# Altium schematic sheet Power.SchDoc
size C; DocumentNumber: 3; SheetNumber: 3; SheetTotal: 8
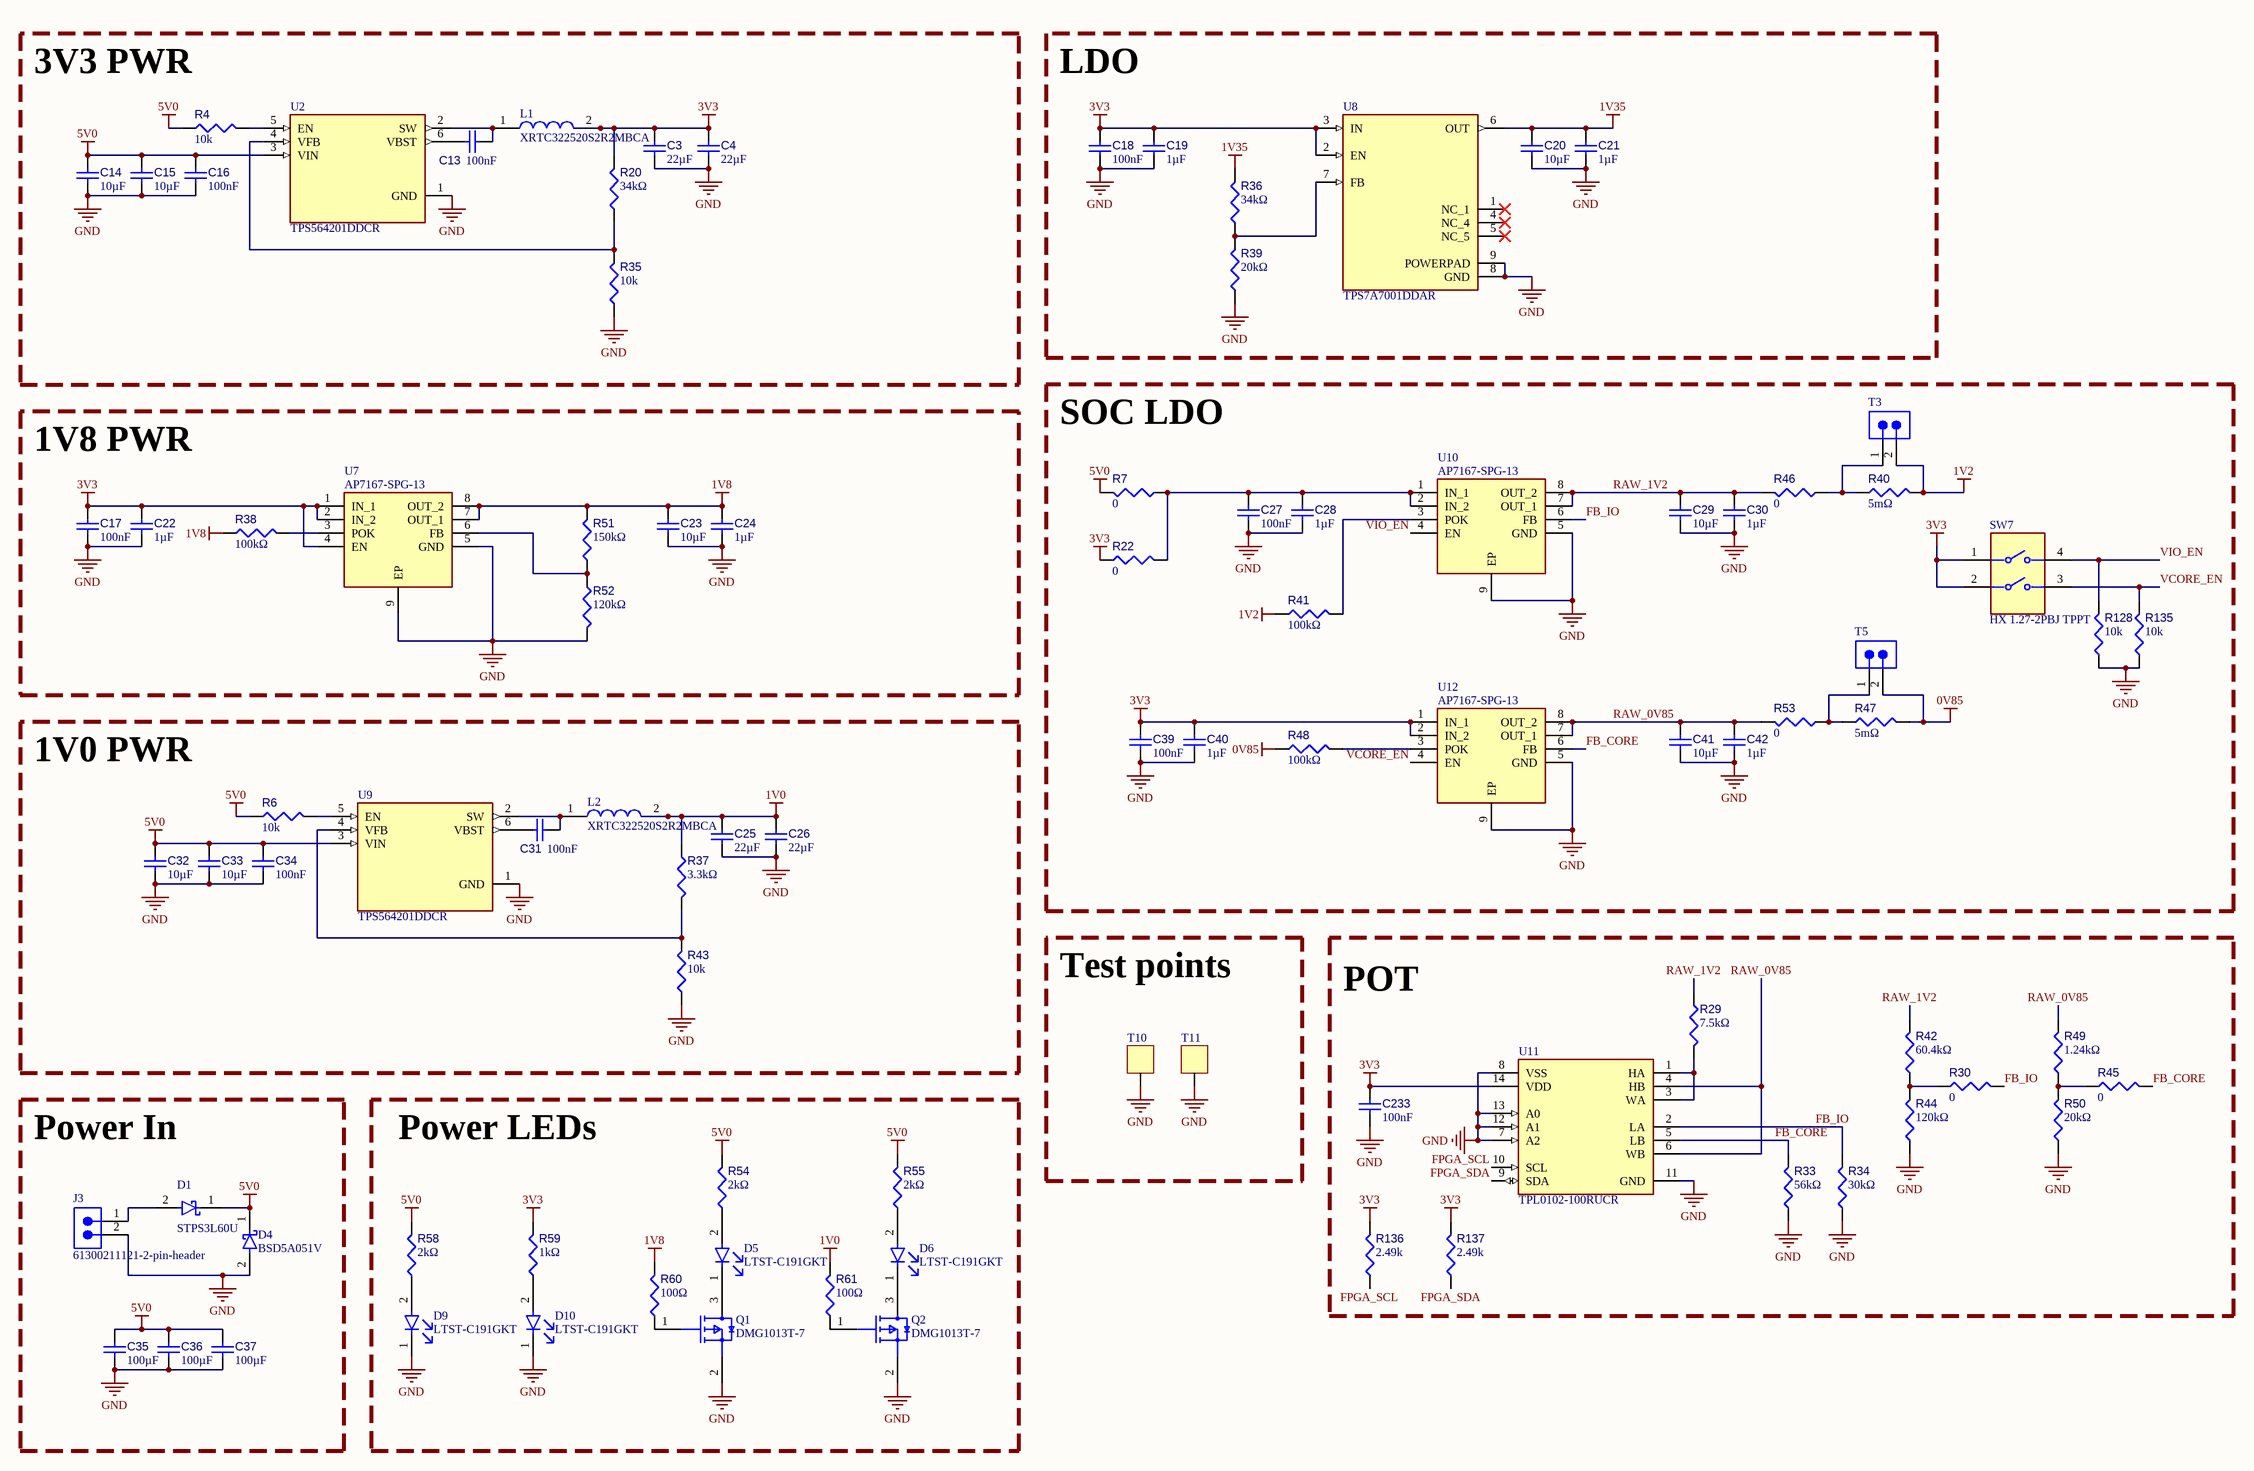
[diagram p0: Power.SchDoc]

## Parts
C3  value 22µF  [CAP-0603-MFG]  (hidden comment: CL10A226MO7JZNC)
C4  value 22µF  [CAP-0603-MFG]  (hidden comment: CL10A226MO7JZNC)
C13  value 100nF  [CAP-0402-MFG]  (hidden comment: CL05B104KA54PNC)
C14  value 10µF  [CAP-0402-MFG]  (hidden comment: CL05A106MP5NUNC)
C15  value 10µF  [CAP-0402-MFG]  (hidden comment: CL05A106MP5NUNC)
C16  value 100nF  [CAP-0402-MFG]  (hidden comment: CL05B104KA54PNC)
C17  value 100nF  [CAP-0402-MFG]  (hidden comment: CL05B104KA54PNC)
C18  value 100nF  [CAP-0402-MFG]  (hidden comment: CL05B104KA54PNC)
C19  value 1µF  [CAP-0402-MFG]  (hidden comment: GRT155C81C105KE13J)
C20  value 10µF  [CAP-0402-MFG]  (hidden comment: CL05A106MP5NUNC)
C21  value 1µF  [CAP-0402-MFG]  (hidden comment: GRT155C81C105KE13J)
C22  value 1µF  [CAP-0402-MFG]  (hidden comment: GRT155C81C105KE13J)
C23  value 10µF  [CAP-0402-MFG]  (hidden comment: CL05A106MP5NUNC)
C24  value 1µF  [CAP-0402-MFG]  (hidden comment: GRT155C81C105KE13J)
C25  value 22µF  [CAP-0603-MFG]  (hidden comment: CL10A226MO7JZNC)
C26  value 22µF  [CAP-0603-MFG]  (hidden comment: CL10A226MO7JZNC)
C27  value 100nF  [CAP-0402-MFG]  (hidden comment: CL05B104KA54PNC)
C28  value 1µF  [CAP-0402-MFG]  (hidden comment: GRT155C81C105KE13J)
C29  value 10µF  [CAP-0402-MFG]  (hidden comment: CL05A106MP5NUNC)
C30  value 1µF  [CAP-0402-MFG]  (hidden comment: GRT155C81C105KE13J)
C31  value 100nF  [CAP-0402-MFG]  (hidden comment: CL05B104KA54PNC)
C32  value 10µF  [CAP-0402-MFG]  (hidden comment: CL05A106MP5NUNC)
C33  value 10µF  [CAP-0402-MFG]  (hidden comment: CL05A106MP5NUNC)
C34  value 100nF  [CAP-0402-MFG]  (hidden comment: CL05B104KA54PNC)
C35  value 100µF  [CAP-0805-MFG]  (hidden comment: GRM21BR60J107ME15L)
C36  value 100µF  [CAP-0805-MFG]  (hidden comment: GRM21BR60J107ME15L)
C37  value 100µF  [CAP-0805-MFG]  (hidden comment: GRM21BR60J107ME15L)
C39  value 100nF  [CAP-0402-MFG]  (hidden comment: CL05B104KA54PNC)
C40  value 1µF  [CAP-0402-MFG]  (hidden comment: GRT155C81C105KE13J)
C41  value 10µF  [CAP-0402-MFG]  (hidden comment: CL05A106MP5NUNC)
C42  value 1µF  [CAP-0402-MFG]  (hidden comment: GRT155C81C105KE13J)
C233  value 100nF  [CAP-0402-MFG]  (hidden comment: CL05B104KA54PNC)
D1  STPS3L60U  [FP-DO214AA-MFG]
D4  BSD5A051V  [SOD-523]
D5  LTST-C191GKT  [LED-0603-MFG]
D6  LTST-C191GKT  [LED-0603-MFG]
D9  LTST-C191GKT  [LED-0603-MFG]
D10  LTST-C191GKT  [LED-0603-MFG]
J3  61300211121-2-pin-header  [61300211121]
L1  XRTC322520S2R2MBCA  [INDC2520X100N]
L2  XRTC322520S2R2MBCA  [INDC2520X100N]
Q1  DMG1013T-7  [FP-SOT523-MFG]
Q2  DMG1013T-7  [FP-SOT523-MFG]
R4  value 10k  [RES-0402]  (hidden comment: AC0402FR-0710KL)
R6  value 10k  [RES-0402]  (hidden comment: AC0402FR-0710KL)
R7  value 0  [RES-0402]  (hidden comment: AC0402JR-130RL)
R20  value 34kΩ  [RES-0402]  (hidden comment: AC0402FR-0734KL)
R22  value 0  [RES-0402]  (hidden comment: AC0402JR-130RL)
R29  value 7.5kΩ  [RES-0402]  (hidden comment: AC0402FR-077K5L)
R30  value 0  [RES-0402]  (hidden comment: AC0402JR-130RL)
R33  value 56kΩ  [RES-0402]  (hidden comment: AF0402FR-0756KL)
R34  value 30kΩ  [RES-0402]  (hidden comment: AC0402FR-0730KL)
R35  value 10k  [RES-0402]  (hidden comment: AC0402FR-0710KL)
R36  value 34kΩ  [RES-0402]  (hidden comment: AC0402FR-0734KL)
R37  value 3.3kΩ  [RES-0402]  (hidden comment: CRCW04023K30FKED)
R38  value 100kΩ  [RES-0402]  (hidden comment: AC0402FR-07100KL)
R39  value 20kΩ  [RES-0402]  (hidden comment: AC0402FR-0720KL)
R40  value 5mΩ  [RES-0603-MFG]  (hidden comment: PA0603FRE570R005L)
R41  value 100kΩ  [RES-0402]  (hidden comment: AC0402FR-07100KL)
R42  value 60.4kΩ  [RES-0402]  (hidden comment: AC0402FR-0760K4L)
R43  value 10k  [RES-0402]  (hidden comment: AC0402FR-0710KL)
R44  value 120kΩ  [RES-0402]  (hidden comment: AC0402FR-07120KL)
R45  value 0  [RES-0402]  (hidden comment: AC0402JR-130RL)
R46  value 0  [RES-0603-MFG]  (hidden comment: AC0603FR-070RL)
R47  value 5mΩ  [RES-0603-MFG]  (hidden comment: PA0603FRE570R005L)
R48  value 100kΩ  [RES-0402]  (hidden comment: AC0402FR-07100KL)
R49  value 1.24kΩ  [RES-0402]  (hidden comment: AC0402FR-071K24L)
R50  value 20kΩ  [RES-0402]  (hidden comment: AC0402FR-0720KL)
R51  value 150kΩ  [RES-0402]  (hidden comment: AF0402FR-07150KL)
R52  value 120kΩ  [RES-0402]  (hidden comment: AC0402FR-07120KL)
R53  value 0  [RES-0603-MFG]  (hidden comment: AC0603FR-070RL)
R54  value 2kΩ  [RES-0402]  (hidden comment: AC0402FR-072KL)
R55  value 2kΩ  [RES-0402]  (hidden comment: AC0402FR-072KL)
R58  value 2kΩ  [RES-0402]  (hidden comment: AC0402FR-072KL)
R59  value 1kΩ  [RES-0402]  (hidden comment: AC0402FR-071KL)
R60  value 100Ω  [RES-0402]  (hidden comment: AC0402FR-07100RL)
R61  value 100Ω  [RES-0402]  (hidden comment: AC0402FR-07100RL)
R128  value 10k  [RES-0402]  (hidden comment: AC0402FR-0710KL)
R135  value 10k  [RES-0402]  (hidden comment: AC0402FR-0710KL)
R136  value 2.49k  [RES-0402]  (hidden comment: AC0402FR-072K49L)
R137  value 2.49k  [RES-0402]  (hidden comment: AC0402FR-072K49L)
SW7  HX 1.27-2PBJ TPPT  [HX 1.27-2PBJ TPPT-Footprint-1]
T3  61300211121-2-pin-header  [61300211121]  (value not drawn)
T5  61300211121-2-pin-header  [61300211121]  (value not drawn)
T10  TEST_PT  [TP-100X100/ROUND-THT]  (value not drawn)
T11  TEST_PT  [TP-100X100/ROUND-THT]  (value not drawn)
U2  TPS564201DDCR  [SOT95P280X110-6N]
U7  AP7167-SPG-13  [SOIC127P600X175-9N]
U8  TPS7A7001DDAR  [VREG_TPS7A7001DDAR]
U9  TPS564201DDCR  [SOT95P280X110-6N]
U10  AP7167-SPG-13  [SOIC127P600X175-9N]
U11  TPL0102-100RUCR  [FP-RUC0014A-IPC_B]
U12  AP7167-SPG-13  [SOIC127P600X175-9N]

## Blocks framed on the sheet
3V3 PWR: C3 C4 C13-C16 L1 R4 R20 R35 U2
LDO: C18-C21 R36 R39 U8
SOC LDO: C27-C30 C39-C42 R7 R22 R40 R41 R46-R48 R53 R128 R135 SW7 T3 T5 U10 U12
1V8 PWR: C17 C22-C24 R38 R51 R52 U7
1V0 PWR: C25 C26 C31-C34 L2 R6 R37 R43 U9
Test points: T10 T11
POT: C233 R29 R30 R33 R34 R42 R44 R45 R49 R50 R136 R137 U11
Power In: C35-C37 D1 D4 J3
Power LEDs: D5 D6 D9 D10 Q1 Q2 R54 R55 R58-R61

## Nets
0V85: R47.2 R48.1 T5.2
1V0: C25.1 C26.1 L2.2 R37.1 R61.2
1V2: R40.2 R41.1 T3.2
1V8: C23.1 C24.1 R38.1 R51.2 R60.2 U7.7(OUT_1) U7.8(OUT_2)
1V35: C20.2 C21.1 R36.2 U8.6(OUT)
3V3: C3.1 C4.1 C17.1 C18.1 C19.1 C22.1 C39.1 C40.1 C233.1 L1.2 R20.2 R22.1 R59.2 R136.2 R137.2 SW7.1 SW7.2 U7.1(IN_1) U7.2(IN_2) U7.4(EN) U8.2(EN) U8.3(IN) U11.14(VDD) U12.1(IN_1) U12.2(IN_2)
5V0: C14.1 C15.1 C16.1 C32.1 C33.2 C34.2 C35.1 C36.1 C37.1 D1.1(K) D4.1(K) R4.1 R6.1 R7.2 R54.2 R55.2 R58.2 U2.3(VIN) U9.3(VIN)
GND: C3.2 C4.2 C14.2 C15.2 C16.2 C17.2 C18.2 C19.2 C20.1 C21.2 C22.2 C23.2 C24.2 C25.2 C26.2 C27.2 C28.2 C29.2 C30.2 C32.2 C33.1 C34.1 C35.2 C36.2 C37.2 C39.2 C40.2 C41.2 C42.2 C233.2 D4.2(A) D9.1(C) D10.1(C) J3.2 Q1.2(S) Q2.2(S) R33.1 R34.1 R35.1 R39.1 R43.1 R44.1 R50.1 R52.2 R128.1 R135.1 T10.1 T11.1 U2.1(GND) U7.5(GND) U7.9(EP) U8.8(GND) U8.9(POWERPAD) U9.1(GND) U10.5(GND) U10.9(EP) U11.7(A2) U11.8(VSS) U11.11(GND) U11.12(A1) U11.13(A0) U12.5(GND) U12.9(EP)
FB_CORE: R33.2 R45.2 U11.5(LB) U12.6(FB)
FB_IO: R30.2 R34.2 U10.6(FB) U11.2(LA)
FPGA_SCL: R136.1 U11.10(SCL)
FPGA_SDA: R137.1 U11.9(SDA)
RAW_0V85: C41.1 C42.1 R49.2 R53.2 U11.4(HB) U11.6(WB) U12.7(OUT_1) U12.8(OUT_2)
RAW_1V2: C29.1 C30.1 R29.1 R42.2 R46.2 U10.7(OUT_1) U10.8(OUT_2)
VCORE_EN: R135.2 SW7.3 U12.4(EN)
VIO_EN: R128.2 SW7.4 U10.4(EN)
NetC13_1: C13.1 L1.1 U2.2(SW)
NetC13_2: C13.2 U2.6(VBST)
NetC27_1: C27.1 C28.1 R7.1 R22.2 U10.1(IN_1) U10.2(IN_2)
NetC31_1: C31.1 U9.6(VBST)
NetC31_2: C31.2 L2.1 U9.2(SW)
NetD1_2: D1.2(A) J3.1
NetD5_1: D5.1(C) Q1.3(D)
NetD5_2: D5.2(A) R54.1
NetD6_1: D6.1(C) Q2.3(D)
NetD6_2: D6.2(A) R55.1
NetD9_2: D9.2(A) R58.1
NetD10_2: D10.2(A) R59.1
NetQ1_1: Q1.1(G) R60.1
NetQ2_1: Q2.1(G) R61.1
NetR4_2: R4.2 U2.5(EN)
NetR6_2: R6.2 U9.5(EN)
NetR20_1: R20.1 R35.2 U2.4(VFB)
NetR29_2: R29.2 U11.1(HA) U11.3(WA)
NetR30_1: R30.1 R42.1 R44.2
NetR36_1: R36.1 R39.2 U8.7(FB)
NetR37_2: R37.2 R43.2 U9.4(VFB)
NetR38_2: R38.2 U7.3(POK)
NetR40_1: R40.1 R46.1 T3.1
NetR41_2: R41.2 U10.3(POK)
NetR45_1: R45.1 R49.1 R50.2
NetR47_1: R47.1 R53.1 T5.1
NetR48_2: R48.2 U12.3(POK)
NetR51_1: R51.1 R52.1 U7.6(FB)

Not connected (* = marked no-connect by the designer): U8 1(NC_1)* 4(NC_4)* 5(NC_5)*

## Library data of the parts
C3 C4 C25 C26 = CMP-104-000117-3: 0603-22u-20%-16V-X5R; Manufacturer Name: Samsung Electro-Mechanics; Tolerance: 20%; Voltage Rating: 16V; Capacitor Type: Ceramic; JLC PN: C2762594; Manufacturer Part Number: CL10A226MO7JZNC; Component Type: Standard; Mounting Technology: Surface Mount; Pins: 2; Pin Count: 2; Design Item ID: CMP-001-00130-1; Info: 0603-22u-20%-16V-X5R; Source: Components - 11.02.26 - 17.26.SchLib; Min Operating Temperature: -55°C; Max Operating Temperature: 85°C; Case/Package: 0603
C13 C16 C31 C34 = CMP-104-000104-6: 0402-100n-10%-25V-X7R-AECQ200; Manufacturer Name: Samsung; Tolerance: 10%; Voltage Rating: 25V; Capacitor Type: Ceramic; Temp Code: X7R; Min Operating Temperature: -55°C; Mounting Technology: Surface Mount; Case/Package: 0402; Max Operating Temperature: 125°C; Pins: 2; Manufacturer Part Number: CL05B104KA54PNC; Design Item ID: CMP-001-00131-1; Source: Components - 11.02.26 - 17.26.SchLib; Info: 0402-100n-10%-25V-X7R-AECQ200; Pin Count: 2; Component Type: Standard; JLC PN: C346180
C14 C15 C20 C23 C29 C32 C33 C41 = CMP-104-000115-6: 0402-10u-20%-10V-X5R; Manufacturer Name: Samsung Electro-Mechanics; Temp Code: X5R; Voltage Rating: 10V; Tolerance: 20%; Capacitor Type: Ceramic; Info: 0402-10u-20%-10V-X5R; Case/Package: 0402; Pins: 2; Max Operating Temperature: 85°C; Mounting Technology: Surface Mount; JLC PN: C315248; Min Operating Temperature: -55°C; Design Item ID: CMP-001-00111-7; Pin Count: 2; Component Type: Standard; Source: Components - 11.02.26 - 17.26.SchLib; Manufacturer Part Number: CL05A106MP5NUNC
C17 C18 C27 C39 C233 = CMP-104-000104-6: 0402-100n-10%-25V-X7R-AECQ200; Manufacturer Name: Samsung; Capacitor Type: Ceramic; Voltage Rating: 25V; Tolerance: 10%; Temp Code: X7R; Min Operating Temperature: -55°C; Component Type: Standard; Max Operating Temperature: 125°C; Case/Package: 0402; Info: 0402-100n-10%-25V-X7R-AECQ200; Pins: 2; Pin Count: 2; Mounting Technology: Surface Mount; Manufacturer Part Number: CL05B104KA54PNC; Design Item ID: CMP-001-00131-1; Source: Components - 11.02.26 - 17.26.SchLib; JLC PN: C346180
C19 C21 C22 C24 C28 C30 C40 C42 = CMP-104-000087-6: 0402-1u-10%-16V-X6S-AECQ200; Manufacturer Name: Murata; Temp Code: X6S; Voltage Rating: 16V; Capacitor Type: Ceramic; Tolerance: 10%; Min Operating Temperature: -55°C; Pin Count: 2; Design Item ID: CMP-001-00112-5; Manufacturer Part Number: GRT155C81C105KE13J; Info: 0402-1u-10%-16V-X6S-AECQ200; Mounting Technology: Surface Mount; Component Type: Standard; Case/Package: 0402; Source: Components - 11.02.26 - 17.26.SchLib; Max Operating Temperature: 105°C; Pins: 2; JLC PN: C908010
C35-C37 = CMP-104-000118-4: 0805-100u-20%-6.3V-X5R; Manufacturer Name: Murata; Voltage Rating: 6.3V; Temp Code: X5R; Capacitor Type: Ceramic; Tolerance: 20%; Design Item ID: CMP-001-00132-1; Source: Components - 11.02.26 - 17.26.SchLib; Min Operating Temperature: -55°C; Info: 0805-100u-20%-6.3V-X5R; Mounting Technology: Surface Mount; JLC PN: C141660; Case/Package: 0805; Component Type: Standard; Pin Count: 2; Max Operating Temperature: 85°C; Manufacturer Part Number: GRM21BR60J107ME15L; Pins: 2
D1 = CMP-090-000051-3: DO214AA-UNI-SCHOTTKY-60V-3A-590mV; Manufacturer Name: STMicroelectronics; Forward Current: 3A; Reverse Standoff Voltage: 60V; Max Reverse Leakage Current: 150µA; Forward Voltage: 590mV; Max Operating Temperature: 150°C; Min Operating Temperature: -65°C; Mounting Technology: Surface Mount; Case/Package: DO-214AA, SMB; Info: DO214AA-UNI-SCHOTTKY-60V-3A-590mV; JLC PN: C132769; Manufacturer Part Number: STPS3L60U
D4 = CMP-090-000052-2: TVS ESD protection clamp generic; Manufacturer Name: BORN; Source: BWRC.SchLib; Package: SOD-523; Design Item ID: DISCRETE_TVS; JLC PN: C151987; Manufacturer Part Number: BSD5A051V
D5 D6 D9 D10 = CMP-132-000002-2: LED yellow green 0603 wavelength 569nm light intensity 12mcd Front Mounting; Manufacturer Name: Lite-On; Forward Current: 30mA; Viewing Angle: 130°; Power Rating: 100mW; Forward Voltage: 2.6V; Pins: 2; JLC PN: C99289; Color: Green; Max Operating Temperature: 85°C; Wavelength: 569nm; Manufacturer Part Number: LTST-C191GKT; Case/Package: 0603; Min Operating Temperature: -55°C; Mounting Technology: Surface Mount
J3 = CMP-00023-3: Board Connector, 2 Contact(s), 1 Row(s), Male, Straight, 0.1 inch Pitch, Solder Terminal, Locking, Black Insulator, Plug; Manufacturer Name: Wurth Electronik; Number Of Connectors: 1; Rated Current (Signal): 3A; Reference Standard: UL; PCB Contact Pattern: RECTANGULAR; Body Length: 0.2inch; DIN Conformance: No; Option: General Purpose; Number of Contacts: 2; Contact Style: SQ PIN-SKT; Dielectric Withstanding Voltage (AC): 500V; Contact Resistance: 20mR; Reliability: COMMERCIAL; Insulation Resistance: 1GR; Mounting Technology: Board; Mating Contact Pitch: 0.1inch; Insulation Material: Polybutylene; Terminal Length: 0.118inch; RoHS Compliant: Yes; Body/Shell Style: PLUG; Flammability Rating: UL94 V-0; Body Breadth: 0.1inch; Termination: Solder; Manufacturer Part Number: 61300211121; Max Operating Temperature: 125°C; Mounting Style: STRAIGHT; IEC Conformance: No; JLC PN: C2915055; Number of Rows Loaded: 1; Contact Material: Copper Alloy; Min Operating Temperature: -40°C; Contact Pattern: RECTANGULAR; MIL Conformance: No; Contact Finish - Mating: GOLD; Body Depth: 0.1inch; Connector Type: BOARD CONNECTOR; Mixed Contacts: No; Terminal Pitch: 2.54mm; Insulation Color: Black; Contact Finish - Termination: Gold (Au) - with Nickel (Ni) barrier; Reach SVHC Compliant: Yes; JESD-609 Code: e4; Contact Gender: Male; Filter Feature: No; Mounting Option 1: LOCKING
L1 L2 = CMP-009-000011-4: Ind,3.2x2.5x1mm,2.2uH?20%,4A,shd; Manufacturer Name: XR; Design Item ID: XRTC322520S2R2MBCA; Source: SamacSys.SchLib; Height: 1mm; JLC PN: C48391578; Manufacturer Part Number: XRTC322520S2R2MBCA
Q1 Q2 = CMP-00055-3: P-Channel 20 V 0.7 Ohm 0.27 W Enhancement Mode Mosfet - SOT-523; Manufacturer Name: Diodes Inc; Power Dissipation: 270mW; Rds On Max: 700mΩ; Drain to Source Voltage (Vdss): -20V; Gate to Source Voltage (Vgs): 6V; Max Operating Temperature: 150°C; Min Operating Temperature: -55°C; Mounting Technology: Surface Mount; Max Power Dissipation: 270mW; Case/Package: SOT-523; Pins: 3; JLC PN: C96676; Manufacturer Part Number: DMG1013T-7
R4 R6 R35 R43 = CMP-014-000077-5: 0402-10k-1%-1/16W-AEC-Q200; Manufacturer Name: YAGEO; Voltage Rating: 50V; Power: 63mW; Tolerance: 1%; Max Operating Temperature: 155°C; Case/Package: 0402; Mounting Technology: Surface Mount; Pins: 2; Min Operating Temperature: -55°C; Source: Components - 11.02.26 - 17.27.SchLib; Design Item ID: CMP-009-00191-3; Info: 0402-10k-1%-1/16W-AEC-Q200; Pin Count: 2; Component Type: Standard; Manufacturer Part Number: AC0402FR-0710KL; JLC PN: C144807
R7 R22 R30 R45 = CMP-014-000080-5: 0402-0-1A-AEC-Q200; Manufacturer Name: YAGEO; Current Rating: 1A; Voltage Rating: 50V; Manufacturer Part Number: AC0402JR-130RL; Pin Count: 2; Source: Components - 11.02.26 - 17.27.SchLib; Min Operating Temperature: -55°C; Component Type: Standard; Max Operating Temperature: 155°C; Design Item ID: CMP-009-00194-1; Mounting Technology: Surface Mount; Info: 0402-0-1A-AEC-Q200; Pins: 2; Case/Package: 0402; JLC PN: C4288031
R20 R36 = CMP-014-000101-4: 0402-34k-1%-1/16W-AEC-Q200; Manufacturer Name: YAGEO; Tolerance: 1%; Power: 63mW; Voltage Rating: 50V; Pins: 2; Pin Count: 2; Max Operating Temperature: 155°C; Case/Package: 0402; Info: 0402-34k-1%-1/16W-AEC-Q200; Component Type: Standard; Design Item ID: CMP-009-00208-2; Min Operating Temperature: -55°C; Source: Components - 11.02.26 - 17.27.SchLib; Manufacturer Part Number: AC0402FR-0734KL; Mounting Technology: Surface Mount; JLC PN: C227006
R29 = CMP-014-000115-4: 0402-7.5k-1%-1/16W-AEC-Q200; Manufacturer Name: Vishay; Manufacturer Part Number: CRCW04027K50FKED; Voltage Rating: 50V; Tolerance: 1%; Power: 63mW; Component Type: Standard; Pins: 2; Case/Package: 0402; Pin Count: 2; Info: 0402-7.5k-1%-1/16W-AEC-Q200; Max Operating Temperature: 155°C; Mounting Technology: Surface Mount; Design Item ID: CMP-009-00197-1; Min Operating Temperature: -55°C; Source: Components - 11.02.26 - 17.27.SchLib; JLC PN: C482236
R33 = CMP-014-000113-4: 0402-56k-1%-1/16W-AEC-Q200; Manufacturer Name: YAGEO; Tolerance: 1%; Voltage Rating: 50V; Power: 63mW; Min Operating Temperature: -55°C; Design Item ID: CMP-009-00210-1; Source: Components - 11.02.26 - 17.27.SchLib; Mounting Technology: Surface Mount; Manufacturer Part Number: AF0402FR-0756KL; Pins: 2; Max Operating Temperature: 155°C; Info: 0402-56k-1%-1/16W-AEC-Q200; Case/Package: 0402; JLC PN: C4288121
R34 = CMP-014-000114-4: 0402-30k-1%-1/16W-AEC-Q200; Manufacturer Name: YAGEO; Tolerance: 1%; Power: 63mW; Voltage Rating: 50V; Info: 0402-30k-1%-1/16W-AEC-Q200; Mounting Technology: Surface Mount; Source: Components - 11.02.26 - 17.27.SchLib; Max Operating Temperature: 155°C; Design Item ID: CMP-009-00210-1; Case/Package: 0402; Min Operating Temperature: -55°C; Pins: 2; Manufacturer Part Number: AC0402FR-0730KL; JLC PN: C412503
R37 = CMP-014-000106-4: 0402-3.3k-1%-1/16W-AEC-Q200; Manufacturer Name: Vishay; Power: 63mW; Tolerance: 1%; Voltage Rating: 50V; Mounting Technology: Surface Mount; Case/Package: 0402; Design Item ID: CMP-009-00197-1; Component Type: Standard; Info: 0402-3.3k-1%-1/16W-AEC-Q200; Min Operating Temperature: -55°C; Pin Count: 2; Source: Components - 11.02.26 - 17.27.SchLib; Pins: 2; Max Operating Temperature: 155°C; Manufacturer Part Number: CRCW04023K30FKED; JLC PN: C482167
R38 R41 R48 = CMP-014-000103-4: 0402-100k-1%-1/16W-AEC-Q200; Manufacturer Name: YAGEO; Tolerance: 1%; Voltage Rating: 50V; Power: 63mW; Min Operating Temperature: -55°C; Pin Count: 2; Component Type: Standard; Manufacturer Part Number: AC0402FR-07100KL; Design Item ID: CMP-009-00205-1; Source: Components - 11.02.26 - 17.27.SchLib; Mounting Technology: Surface Mount; Case/Package: 0402; Pins: 2; Info: 0402-100k-1%-1/16W-AEC-Q200; Max Operating Temperature: 155°C; JLC PN: C144809
R39 = CMP-014-000110-4: 0402-20k-1%-1/16W-AEC-Q200; Manufacturer Name: YAGEO; Tolerance: 1%; Power: 63mW; Voltage Rating: 50V; Source: Components - 11.02.26 - 17.27.SchLib; Design Item ID: CMP-009-00208-2; Component Type: Standard; Info: 0402-20k-1%-1/16W-AEC-Q200; Pin Count: 2; Pins: 2; Case/Package: 0402; Min Operating Temperature: -55°C; Manufacturer Part Number: AC0402FR-0720KL; Max Operating Temperature: 155°C; Mounting Technology: Surface Mount; JLC PN: C144783
R40 R47 = CMP-014-000112-2: 0603-5m-1%-0.5W-AECQ200; Manufacturer Name: YAGEO; Tolerance: 1%; Voltage Rating: 75V; Max Operating Temperature: 155°C; Case/Package: 0603; Info: 0603-5m-1%-0.5W-AECQ200; JLC PN: C1704788; Manufacturer Part Number: PA0603FRE570R005L; Min Operating Temperature: -55°C; Mounting Technology: Surface Mount
R42 = CMP-014-000116-4: 0402-60.4k-1%-1/16W-AEC-Q200; Manufacturer Name: YAGEO; Voltage Rating: 50V; Tolerance: 1%; Power: 63mW; Min Operating Temperature: -55°C; Pins: 2; Manufacturer Part Number: AC0402FR-0760K4L; Info: 0402-60.4k-1%-1/16W-AEC-Q200; Case/Package: 0402; Mounting Technology: Surface Mount; Design Item ID: CMP-009-00210-1; Source: Components - 11.02.26 - 17.27.SchLib; Max Operating Temperature: 155°C; JLC PN: C227168
R44 R52 = CMP-014-000105-4: 0402-120k-1%-1/16W-AEC-Q200; Manufacturer Name: YAGEO; Power: 63mW; Voltage Rating: 50V; Tolerance: 1%; Source: Components - 11.02.26 - 17.27.SchLib; Mounting Technology: Surface Mount; Pins: 2; Pin Count: 2; Manufacturer Part Number: AC0402FR-07120KL; Design Item ID: CMP-009-00205-1; Component Type: Standard; Case/Package: 0402; Min Operating Temperature: -55°C; Max Operating Temperature: 155°C; Info: 0402-120k-1%-1/16W-AEC-Q200; JLC PN: C144802
R46 R53 = CMP-014-000111-3: 0603-0-1A-AECQ200; Manufacturer Name: YAGEO; Voltage Rating: 75V; Tolerance: 1%; Mounting Technology: Surface Mount; JLC PN: C116699; Info: 0603-0-1A-AECQ200; Manufacturer Part Number: AC0603FR-070RL; Min Operating Temperature: -55°C; Max Operating Temperature: 155°C; Case/Package: 0603
R49 = CMP-014-000117-4: 0402-1.24k-1%-1/16W-AEC-Q200; Manufacturer Name: YAGEO; Voltage Rating: 50V; Power: 63mW; Tolerance: 1%; Pin Count: 2; Source: Components - 11.02.26 - 17.27.SchLib; Pins: 2; Case/Package: 0402; Max Operating Temperature: 155°C; Info: 0402-1.24k-1%-1/16W-AEC-Q200; Min Operating Temperature: -55°C; Design Item ID: CMP-009-00193-2; Mounting Technology: Surface Mount; Manufacturer Part Number: AC0402FR-071K24L; JLC PN: C226846
R50 = CMP-014-000110-4: 0402-20k-1%-1/16W-AEC-Q200; Manufacturer Name: YAGEO; Tolerance: 1%; Voltage Rating: 50V; Power: 63mW; Min Operating Temperature: -55°C; Pin Count: 2; Component Type: Standard; Manufacturer Part Number: AC0402FR-0720KL; Design Item ID: CMP-009-00208-2; Source: Components - 11.02.26 - 17.27.SchLib; Mounting Technology: Surface Mount; Case/Package: 0402; Pins: 2; Info: 0402-20k-1%-1/16W-AEC-Q200; Max Operating Temperature: 155°C; JLC PN: C144783
R51 = CMP-014-000104-4: 0402-150k-1%-1/16W-AEC-Q200; Manufacturer Name: YAGEO; Power: 63mW; Tolerance: 1%; Voltage Rating: 50V; Case/Package: 0402; Design Item ID: CMP-009-00195-1; Source: Components - 11.02.26 - 17.27.SchLib; Min Operating Temperature: -55°C; Component Type: Standard; Pins: 2; Mounting Technology: Surface Mount; Max Operating Temperature: 155°C; Info: 0402-150k-1%-1/16W-AEC-Q200; Manufacturer Part Number: AF0402FR-07150KL; Pin Count: 2; JLC PN: C144033
R54 R55 R58 = CMP-014-000107-4: 0402-2k-1%-1/16W-AEC-Q200; Manufacturer Name: YAGEO; Voltage Rating: 50V; Tolerance: 1%; Power: 63mW; Source: Components - 11.02.26 - 17.27.SchLib; Design Item ID: CMP-009-00190-1; Max Operating Temperature: 155°C; Mounting Technology: Surface Mount; Case/Package: 0402; Component Type: Standard; Min Operating Temperature: -55°C; Info: 0402-2k-1%-1/16W-AEC-Q200; Pins: 2; Manufacturer Part Number: AC0402FR-072KL; Pin Count: 2; JLC PN: C144770
R59 = CMP-014-000078-5: 0402-1k-1%-1/16W-AEC-Q200; Manufacturer Name: YAGEO; Voltage Rating: 50V; Power: 63mW; Tolerance: 1%; Manufacturer Part Number: AC0402FR-071KL; Pins: 2; Min Operating Temperature: -55°C; Max Operating Temperature: 155°C; Case/Package: 0402; Pin Count: 2; Source: Components - 11.02.26 - 17.27.SchLib; Mounting Technology: Surface Mount; Design Item ID: CMP-009-00192-1; Info: 0402-1k-1%-1/16W-AEC-Q200; Component Type: Standard; JLC PN: C144789
R60 R61 = CMP-014-000108-4: 0402-100-1%-1/16W-AEC-Q200; Manufacturer Name: YAGEO; Voltage Rating: 50V; Power: 63mW; Tolerance: 1%; Source: Components - 11.02.26 - 17.27.SchLib; Design Item ID: CMP-009-00202-1; Case/Package: 0402; Manufacturer Part Number: AC0402FR-07100RL; Mounting Technology: Surface Mount; Pin Count: 2; Component Type: Standard; Max Operating Temperature: 155°C; Pins: 2; Min Operating Temperature: -55°C; Info: 0402-100-1%-1/16W-AEC-Q200; JLC PN: C144808
R128 R135 = CMP-014-000077-5: 0402-10k-1%-1/16W-AEC-Q200; Manufacturer Name: YAGEO; Tolerance: 1%; Voltage Rating: 50V; Power: 63mW; Pins: 2; Source: Components - 11.02.26 - 17.27.SchLib; Manufacturer Part Number: AC0402FR-0710KL; Info: 0402-10k-1%-1/16W-AEC-Q200; Min Operating Temperature: -55°C; Pin Count: 2; Case/Package: 0402; Design Item ID: CMP-009-00191-3; Max Operating Temperature: 155°C; Component Type: Standard; Mounting Technology: Surface Mount; JLC PN: C144807
R136 R137 = CMP-014-000093-5: 0402-2.49k-1%-1/16W-AECQ200; Manufacturer Name: YAGEO; Tolerance: 1%; Power: 63mW; Voltage Rating: 50V; Source: Components - 11.02.26 - 17.27.SchLib; Case/Package: 0402; Info: 0402-2.49k-1%-1/16W-AECQ200; Max Operating Temperature: 155°C; Pin Count: 2; Design Item ID: CMP-009-00207-1; Component Type: Standard; Manufacturer Part Number: AC0402FR-072K49L; Mounting Technology: Surface Mount; Pins: 2; Min Operating Temperature: -55°C; JLC PN: C226959
SW7 = CMP-051-000044-4: Dual 1.27mm SMT DIP Switch; Manufacturer Name: hanxia; JLC PN: C7430304; Manufacturer Part Number: HX 1.27-2PBJ TPPT
T3 T5 = CMP-00023-3: Board Connector, 2 Contact(s), 1 Row(s), Male, Straight, 0.1 inch Pitch, Solder Terminal, Locking, Black Insulator, Plug; Manufacturer Name: Wurth Electronik; Number Of Connectors: 1; Rated Current (Signal): 3A; Number of Contacts: 2; DIN Conformance: No; Option: General Purpose; Contact Style: SQ PIN-SKT; Reliability: COMMERCIAL; Insulation Resistance: 1GR; PCB Contact Pattern: RECTANGULAR; Contact Resistance: 20mR; Dielectric Withstanding Voltage (AC): 500V; Reference Standard: UL; Body Length: 0.2inch; Contact Gender: Male; Body/Shell Style: PLUG; Flammability Rating: UL94 V-0; Contact Finish - Mating: GOLD; Insulation Material: Polybutylene; Insulation Color: Black; Connector Type: BOARD CONNECTOR; Mounting Technology: Board; Reach SVHC Compliant: Yes; Mating Contact Pitch: 0.1inch; IEC Conformance: No; Body Breadth: 0.1inch; Mounting Option 1: LOCKING; Number of Rows Loaded: 1; RoHS Compliant: Yes; Terminal Length: 0.118inch; Terminal Pitch: 2.54mm; Termination: Solder; Contact Material: Copper Alloy; JESD-609 Code: e4; Body Depth: 0.1inch; Max Operating Temperature: 125°C; MIL Conformance: No; Mixed Contacts: No; Contact Finish - Termination: Gold (Au) - with Nickel (Ni) barrier; Mounting Style: STRAIGHT; Min Operating Temperature: -40°C; Filter Feature: No; Contact Pattern: RECTANGULAR; Manufacturer Part Number: 61300211121; JLC PN: C2915055
T10 T11 = CMP-016-000000-1: Test point 1 pin; Source: BWRC.SchLib; Design Item ID: TEST_PT
U2 U9 = CMP-102-000000-2: IC REG BUCK ADJ 4A SOT23 "Buck Switching Regulator IC Positive Adjustable 0.76V 1 Output 4A SOT-23-6 Thin, TSOT-23-6"; Manufacturer Name: Texas Instruments; Switching Frequency: 560kHz; Max Supply Voltage: 17V; Min Input Voltage: 4.5V; Min Output Voltage: 760mV; Max Output Voltage: 7V; Max Operating Temperature: 125°C; Output Current: 4A; Output Type: Adjustable; Case/Package: SOT-23-6; JLC PN: C464812; Topology: Buck; Min Operating Temperature: -40°C; Pins: 6; Manufacturer Part Number: TPS564201DDCR
U7 U10 U12 = CMP-017-000441-4: AP7167 Series 5.5 V 1.2 A Low Dropout Regulator with Pok - SOP-8EP; Manufacturer Name: Diodes Incorporated; Min Input Voltage: 2.2V; Max Output current: 1.2A; Max Power Dissipation: 1.9W; Output Voltage: 5V; Power Rating: 4W; Output Type: Adjustable; Max Supply Voltage: 5.5V; Dropout Voltage: 500mV; Height: 1.75mm; Min Operating Temperature: -40°C; Mounting Technology: Surface Mount; Max Operating Temperature: 85°C; RoHS: Compliant; Case/Package: SOIC; Output Current: 1.2A; JLC PN: C155313; Pins: 8; Manufacturer Part Number: AP7167-SPG-13
U8 = CMP-135-000000-4: 2-A, adjustable ultra-low-dropout voltage regulator with enable; Manufacturer Name: Texas Instruments; Max Output current: 2A; Dropout Voltage: 380mV; Min Input Voltage: 1.5V; Min Output Voltage: 900mV; Max Output Voltage: 5V; Max Supply Voltage: 6.5V; Package: HSOIC-8 Texas Instruments; JLC PN: C60719; Manufacturer Part Number: TPS7A7001DDAR; Min Operating Temperature: -40°C; Case/Package: SOIC; Pins: 8; Output Type: Adjustable; Max Operating Temperature: 125°C
U11 = CMP-051-000046-2: Digital Potentiometer 100kOhm 256POS Non-Volatile Linear 14-Pin X2QFN T/R; Manufacturer Name: Texas Instruments; Number of Channels: 2; Interface: I2C; Value: 100kΩ; Number of Positions: 256; Min Supply Voltage: 2.7V; Tolerance: 20%; Max Supply Voltage: 5.5V; Height: 400µm; JLC PN: C2649365; Case/Package: QFN; Composition: Potentiometer; Min Operating Temperature: -40°C; Max Operating Temperature: 85°C; Pins: 14; Manufacturer Part Number: TPL0102-100RUCR